# Altium schematic sheet cpu2_lock_comm.SchDoc
size A3; DocumentNumber: 7; Revision: V1.0; SheetNumber: 7; SheetTotal: 9; Rule: PcbType=ProtelPcb
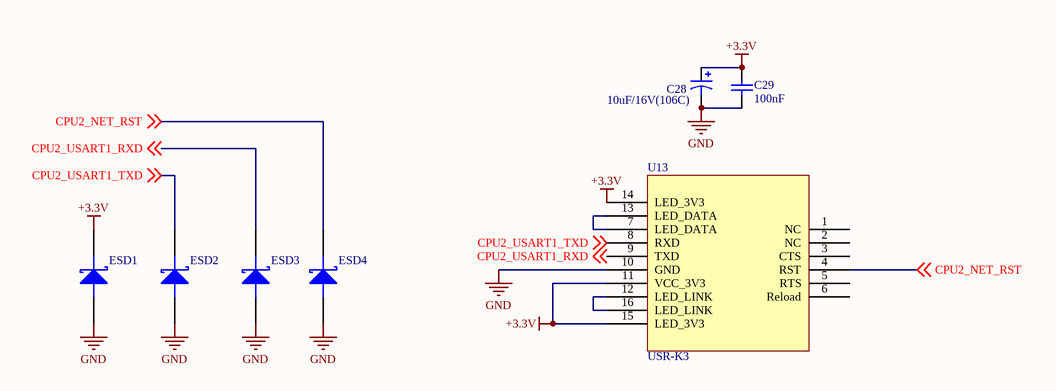
[diagram p0: cpu2_lock_comm.SchDoc]

## Parts
C28  value 10uF/16V(106C)  [CAP A-3216]  (hidden comment: Cap Pol3)
C29  100nF  [0805_C]
ESD1  ESD5B5.0ST1G  [SOD-523]  (value not drawn)
ESD2  ESD5B5.0ST1G  [SOD-523]  (value not drawn)
ESD3  ESD5B5.0ST1G  [SOD-523]  (value not drawn)
ESD4  ESD5B5.0ST1G  [SOD-523]  (value not drawn)
U13  USR-K3  [USR-K3]

## Nets
+3.3V: C28.1 C29.2 ESD1.2 U13.11(VCC_3V3) U13.14(LED_3V3) U13.15(LED_3V3)
GND: C28.2 C29.1 ESD1.1 ESD2.1 ESD3.1 ESD4.1 U13.10(GND)
CPU2_NET_RST: ESD4.2 U13.4(RST) ; off-sheet CPU2_NET_RST
CPU2_USART1_RXD: ESD3.2 U13.9(TXD) ; off-sheet CPU2_USART1_RXD
CPU2_USART1_TXD: ESD2.2 U13.8(RXD) ; off-sheet CPU2_USART1_TXD
NetU13_7: U13.7(LED_DATA) U13.13(LED_DATA)
NetU13_12: U13.12(LED_LINK) U13.16(LED_LINK)

Not connected (* = marked no-connect by the designer): U13 1(NC) 2(NC) 3(CTS) 5(RTS) 6(Reload)

## Notes on the sheet
- :

## Library data of the parts
C28 = Cap Pol3: Polarized Capacitor (Surface Mount); Published: 8-Jun-2000; LatestRevisionDate: 17-Jul-2002; LatestRevisionNote: Re-released for DXP Platform.; PackageReference: C0805; Publisher: Altium Limited
C29 = 0805 100nF(104) 10% 50V: 贴片电容; ComponentLink1Description: 供应商链接; ComponentLink1URL: http://www.szlcsc.com/product/details_50686.html; Package: 0805; Supplier: LC; SuppliersPartNumber: C49678